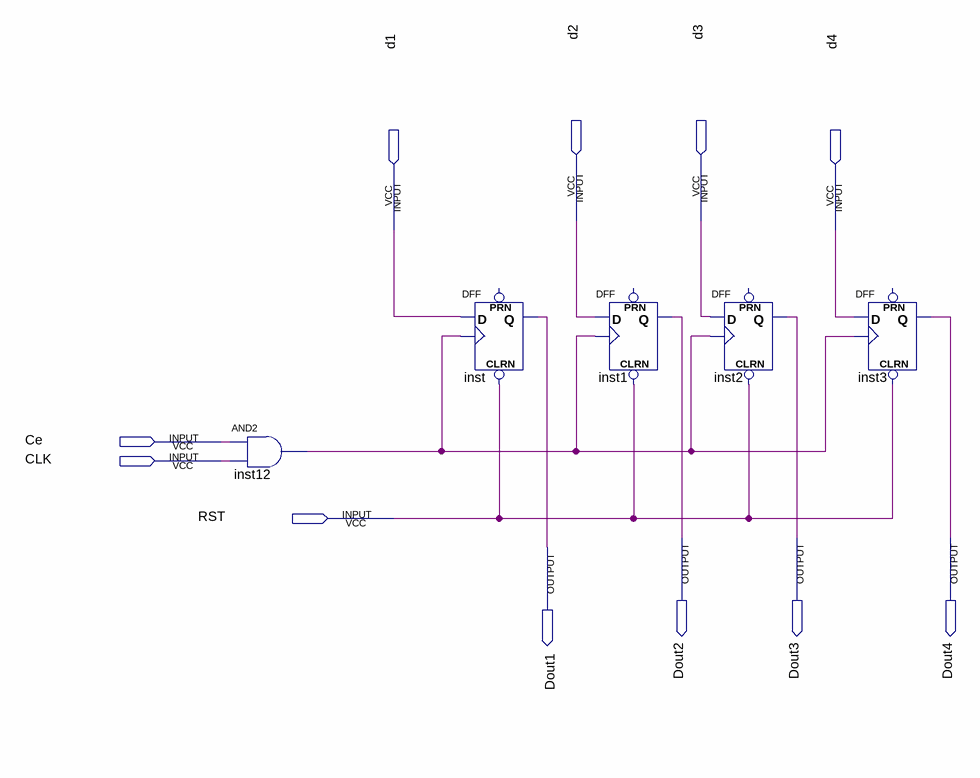
[diagram p0: schematic sheet]
// Quartus schematic ex4.bdf as structural Verilog: 5 symbols, 11 pins
module ex4 (
  input  d2,
  input  d3,
  input  d1,
  input  d4,
  input  Ce,
  input  CLK,
  input  RST,
  output Dout2,
  output Dout3,
  output Dout4,
  output Dout1
);

  wire inst12_out;

  and inst12 (inst12_out, Ce, CLK);
  DFF inst (.CLRN(RST), .CLK(inst12_out), .D(d1), .Q(Dout1));  // open: PRN
  DFF inst1 (.CLRN(RST), .CLK(inst12_out), .D(d2), .Q(Dout2));  // open: PRN
  DFF inst2 (.CLRN(RST), .CLK(inst12_out), .D(d3), .Q(Dout3));  // open: PRN
  DFF inst3 (.CLRN(RST), .CLK(inst12_out), .D(d4), .Q(Dout4));  // open: PRN
endmodule
